# EAGLE design dc-dcconverter (EAGLE 9.6.2)
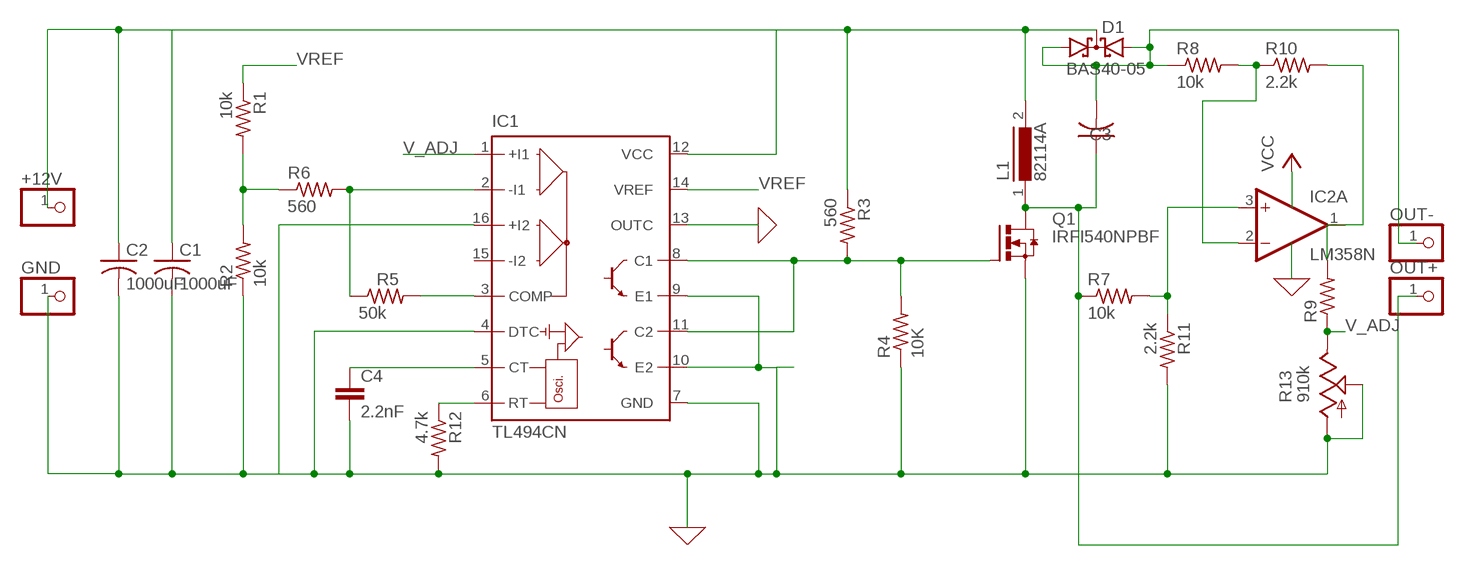
[diagram p0: schematic, sheet 1]

## Parts
+12V  PINHD-1X1  [1X01]
C1  1000uF  C-US025-024X044  [C025-024X044]
C2  1000uF  C-US025-024X044  [C025-024X044]
C3  C-US025-024X044  [C025-024X044]
C4  2.2nF  C2,5-3  [C2.5-3]
D1  BAS40-05  [SOT23]
GND  PINHD-1X1  [1X01]
IC1  TL494CN  [DIL16]
IC2  LM358N  [DIL08]
L1  82114A  [82114A]
OUT+  PINHD-1X1  [1X01]
OUT-  PINHD-1X1  [1X01]
Q1  IRFI540NPBF  [TO220BH]
R1  10k  R-US_0204/5  [0204/5]
R2  10k  R-US_0204/5  [0204/5]
R3  560  R-US_0204/5  [0204/5]
R4  10K  R-US_0204/5  [0204/5]
R5  50k  R-US_0204/5  [0204/5]
R6  560  R-US_0204/5  [0204/5]
R7  10k  R-US_0204/5  [0204/5]
R8  10k  R-US_0204/5  [0204/5]
R9  R-US_0204/5  [0204/5]
R10  2.2k  R-US_0204/5  [0204/5]
R11  2.2k  R-US_0204/5  [0204/5]
R12  4.7k  R-US_0204/5  [0204/5]
R13  910k  TRIM_US-CA6H  [CA6H]

## Nets
0: IC1.13(OUTC) ; supply symbol labelled GND
GND: C1.2 C2.2 C4.2 GND.1 IC1.4(DTC) IC1.7(GND) IC1.9(E1) IC1.10(E2) IC1.16(+I2) Q1.S R2.1 R4.1 R11.2 R12.2 R13.A R13.S
N$1: IC1.2(-I1) R5.1 R6.2
N$2: IC1.3(COMP) R5.2
N$4: IC1.6(RT) R12.1
N$5: C4.1 IC1.5(CT)
N$6: IC1.8(C1) IC1.11(C2) Q1.G R3.2 R4.2
N$7: IC2.2(A:-IN) R8.2 R10.1
N$8: C3.1 L1.1 OUT+.1 Q1.D R7.1
N$9: C3.2 D1.1(A1) D1.2(A2) OUT-.1 R8.1
N$10: IC2.1(A:OUT) R9.2 R10.2
N$11: R1.2 R2.2 R6.1
N$12: IC1.14(VREF)
N$13: IC2.3(A:+IN) R7.2 R11.1
N$14: IC1.1(+I1)
N$15: +12V.1 C1.1 C2.1 D1.3(C) IC1.12(VCC) L1.2 R3.1
V_ADJ: R9.1 R13.E
VREF: R1.1
Unconnected: IC1.15(-I2) IC2.5(B:+IN) IC2.6(B:-IN) IC2.7(B:OUT)

## Power pins joined to a net without a drawn wire
V+: IC2.8(P:V+)
V-: IC2.4(P:V-)

## Library data of the parts
+12V GND OUT+ OUT- = adafruit:PINHD-1X1: Pin header 1x1 for 0.1" spacing With round pins
C1-C3 = adafruit:C-US: CAPACITOR, American symbol
C4 = capacitor-wima:C: CAPACITOR naming: grid - package width
D1 = diode:BAS40-05: Silicon Schottky Diodes General-purpose diode for high-speed switching
IC1 = linear:TL494*: SWITCHMODE Pulse Width Modulation Control Circuit NCV494B http://onsemi.com tl494-d.pdf
IC2 = linear:LM358: OP AMP also LM158; LM258; LM2904 Source: http://cache.national.com/ds/LM/LM158.pdf
L1 = inductors:82114A: INDUCTOR; SPICEPREFIX: L
Q1 = transistor-power:IRFI540NPBF: HEXFET Power MOISFET VDSS = 100V, RDS(on) = 0.052 Ohm, ID = 20A, VGS(th) = 2.0 -- 4.0V Source: http://www.irf.com/product-info/datasheets/data/irfi540npbf.pdf
R1-R12 = rcl:R-US_: RESISTOR, American symbol; SPICEPREFIX: R
R13 = pot:TRIM_US-: POTENTIOMETER

## Board
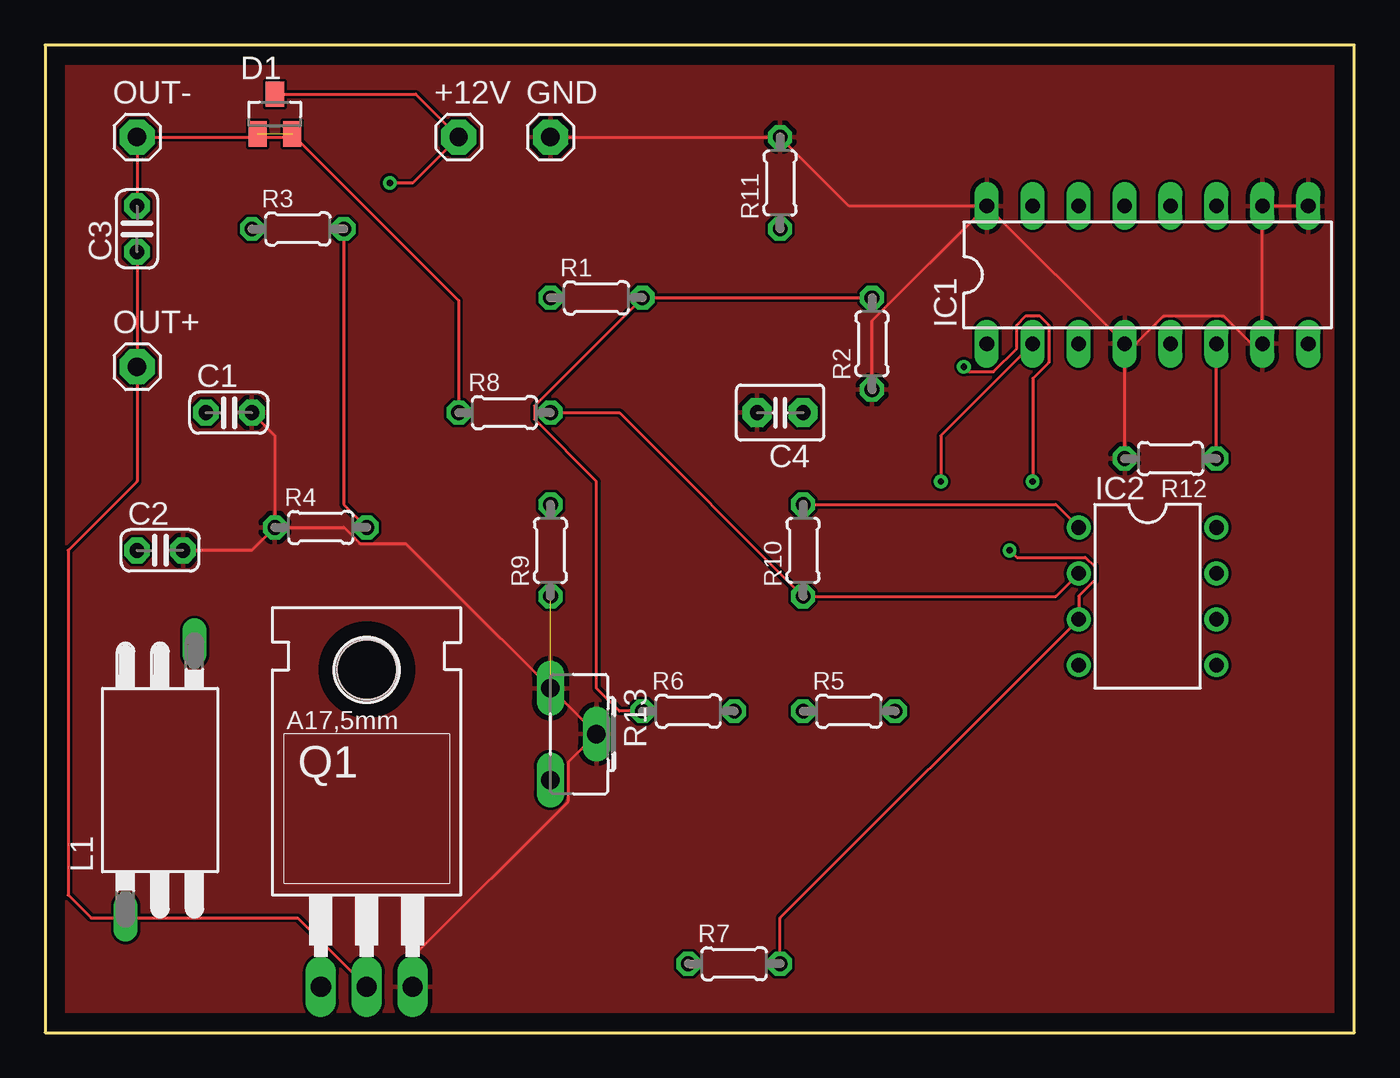
[diagram p1: board, top side]
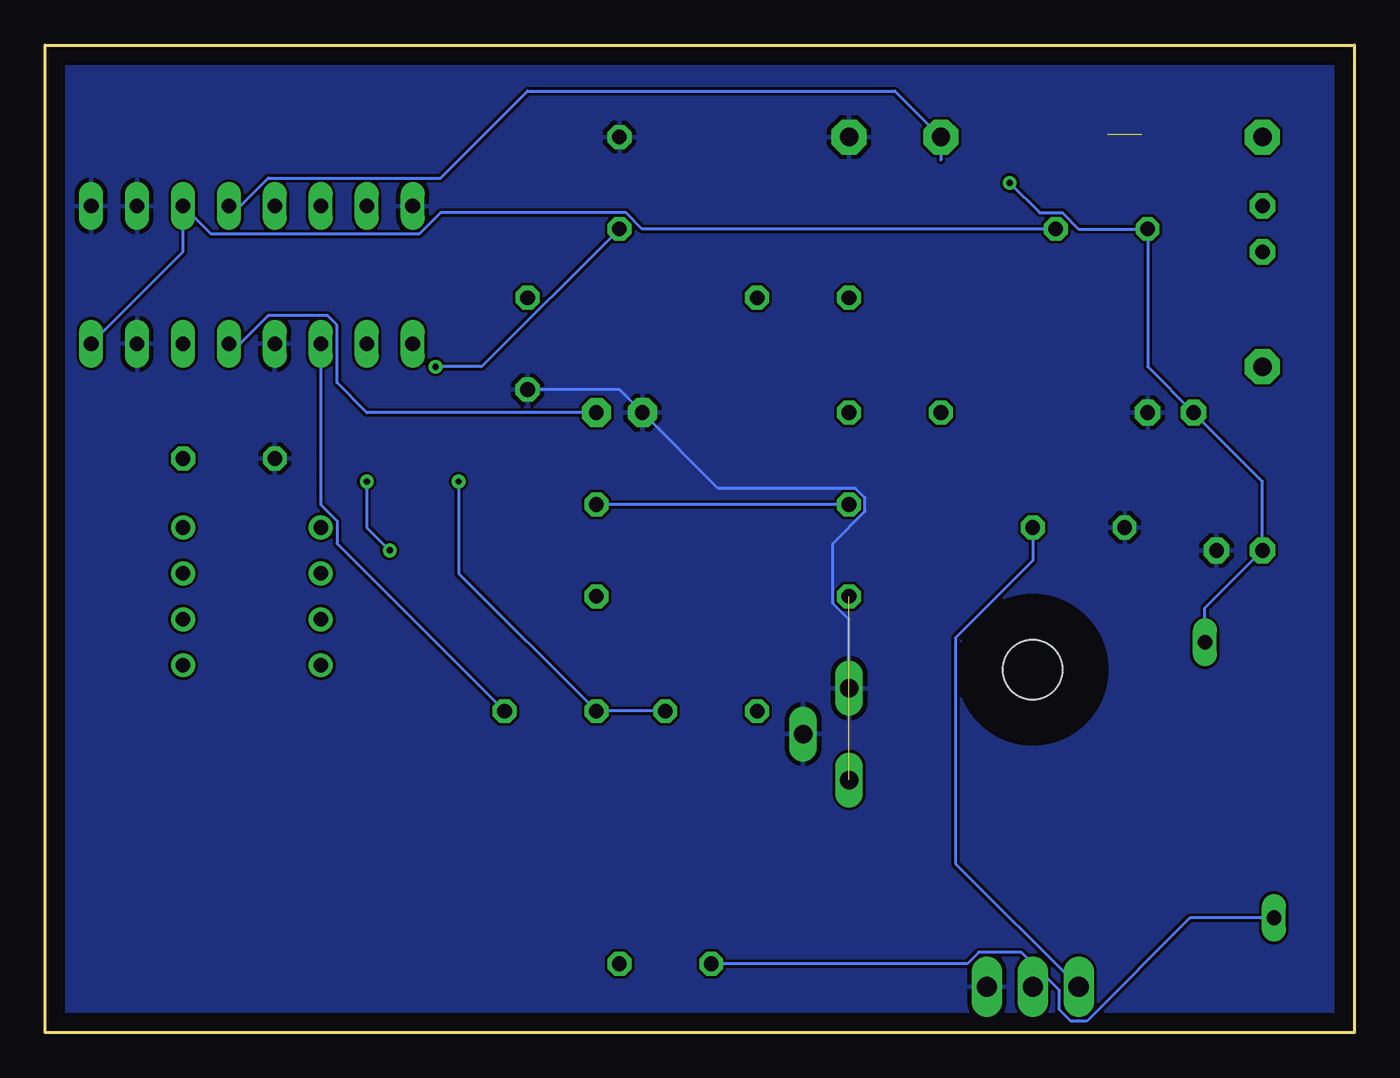
[diagram p2: board, bottom side, seen from below]

Size 72.39 x 54.61 mm. Coordinates in mm from the lower left corner, seen from the top.
Outline: 0,54.61 0,0 72.39,0 72.39,54.61 0,54.61
Copper layers (1*16): Top 0.035mm / dielectric 1.5mm / Bottom 0.035mm
Design rules "default": minimum track width 6mil, minimum drill 0.35mm, track to track 6mil, track to pad 6mil, pad to pad 6mil, via to via 6mil, smd to smd 6mil, copper to edge 40mil, drill to drill 6mil, minimum pad ring 10mil, minimum via ring 8mil, stop-mask expansion 4mil, vias tented up to drill 0mil, thermal gap 10mil

### Footprints (pad centres in the part's own frame; a part is rotated, then mirrored left to right if it is on the bottom)
1X01 = drill 1.016 pad 1.93 octagon: 1 0,0
C025-024X044 = drill 0.813 pad 1.422 octagon: 1 -1.27,0; 2 1.27,0
C2.5-3 = drill 0.813 pad 1.6 octagon: 1 -1.27,0; 2 1.27,0
SOT23 = smd 1 x 1.4: 1 -0.95,-1.1; 2 0.95,-1.1; 3 0,1.1
DIL16 = drill 0.813 long: 1 -8.89,-3.81; 2 -6.35,-3.81; 3 -3.81,-3.81; 4 -1.27,-3.81; 5 1.27,-3.81; 6 3.81,-3.81; 7 6.35,-3.81; 8 8.89,-3.81; 9 8.89,3.81; 10 6.35,3.81; 11 3.81,3.81; 12 1.27,3.81; 13 -1.27,3.81; 14 -3.81,3.81; 15 -6.35,3.81; 16 -8.89,3.81
DIL08 = drill 0.813 pad 1.27: 1 -3.81,-3.81; 2 -1.27,-3.81; 3 1.27,-3.81; 4 3.81,-3.81; 5 3.81,3.81; 6 1.27,3.81; 7 -1.27,3.81; 8 -3.81,3.81
82114A = drill 0.813 long: 1 -7.62,1.905; 2 7.62,-1.905
TO220BH = drill 1.118 long: D 0,-6.35; G -2.54,-6.35; S 2.54,-6.35 | hole 3.302: 0,11.176
0204/5 = drill 0.813 octagon: 1 -2.54,0; 2 2.54,0
CA6H = drill 1.016 long: A -2.54,0; E 2.54,0; S 0,2.54

### Placement (x,y rotation side)
+12V  22.86,49.53 0 top
C1  10.16,34.29 0 top
C2  6.35,26.67 0 top
C3  5.08,44.45 90 top
C4  40.64,34.29 180 top
D1  12.7,50.8 0 top
GND  27.94,49.53 0 top
IC1  60.96,41.91 0 top
IC2  60.96,24.13 270 top
L1  6.35,13.97 90 top
OUT+  5.08,36.83 0 top
OUT-  5.08,49.53 0 top
Q1  17.78,8.89 0 top
R1  30.48,40.64 0 top
R2  45.72,38.1 90 top
R3  13.97,44.45 0 top
R4  15.24,27.94 0 top
R5  44.45,17.78 0 top
R6  35.56,17.78 0 top
R7  38.1,3.81 0 top
R8  25.4,34.29 0 top
R9  27.94,26.67 90 top
R10  41.91,26.67 90 top
R11  40.64,46.99 90 top
R12  62.23,31.75 180 top
R13  27.94,16.51 270 top

### Tracks (layer width: path | path; a pad name or v marks a point on that pad's centre or on a via)
GND
  Top 0.152: R12.2 IC1.4 | IC1.4 60.31,38.1 61.86,39.65 65.14,39.65 66.69,38.1 IC1.7 IC1.10 IC1.9 | Q1.S 20.32,4.19 28.93,12.8 28.93,14.96 R13.S 19.94,27.05 17.41,27.05 16.52,27.94 R4.1 | C1.2 12.7,33.02 R4.1 | GND.1 R11.2 44.45,45.72 IC1.16 | R4.1 11.43,26.67 C2.2 | IC1.4 IC1.16 | R2.1 45.72,39.37 IC1.16
  Bottom 0.152: R13.A 27.94,22.86 28.83,23.75 28.83,27.06 27.05,28.84 27.05,29.58 27.57,30.1 35.18,30.1 C4.2 40.64,35.56 R2.1
  pour Top (isolate 0.001): 0,53.34 0,0 72.39,0 72.39,54.61 0,54.61
  pour Bottom (isolate 0.001): 0,54.61 0,0 72.39,0 72.39,54.61
N$1  (via drill 0.35)
  Top 0.152: IC1.2 49.53,33.02 v49.53,30.48
  Bottom 0.152: v49.53,30.48 49.53,25.4 R5.1 R6.2
N$2
  Bottom 0.152: IC1.3 57.15,29.2 56.26,28.31 56.26,27.05 R5.2
N$4
  Top 0.152: R12.1 IC1.6
N$5
  Bottom 0.152: IC1.5 61.61,38.1 60.06,39.65 56.78,39.65 56.26,39.13 56.26,35.94 54.61,34.29 C4.1
N$6
  Top 0.152: R3.2 16.51,29.21 R4.2
  Bottom 0.152: R4.2 17.78,26.1 22.05,21.83 22.05,9.35 Q1.G | R3.2 39.38,44.45 40.27,45.34 50.53,45.34 51.7,44.17 63.22,44.17 IC1.11 64.77,43.18 IC1.8
N$7
  Top 0.152: R8.2 31.75,34.29 R10.1 55.88,24.13 IC2.2
N$8
  Top 0.152: C3.1 OUT+.1 5.08,30.48 1.27,26.67 1.27,7.62 2.54,6.35 L1.1 13.97,6.35 Q1.D
  Bottom 0.152: L1.1 9.08,6.35 14.8,0.64 15.68,0.64 16.31,1.26 16.31,2.34 18.41,4.45 20.76,4.45 21.4,3.81 R7.1
N$9  (1 unrouted)
  Top 0.152: D1.2 13.82,49.53 | 13.82,49.53 22.86,40.49 R8.1 | 13.82,49.53 OUT-.1 C3.2
N$10
  Top 0.152: R10.2 55.88,29.21 IC2.1
  Bottom 0.152: R9.2 R10.2
N$11
  Top 0.152: R6.1 31.75,17.78 30.48,19.05 30.48,30.49 27.05,33.92 27.05,34.66 33.02,40.63 R1.2 R2.2
N$13  (via drill 0.35)
  Top 0.152: R7.2 40.64,6.35 IC2.3 57.15,24.14 58.04,25.03 58.04,25.77 57.52,26.29 53.72,26.29 v53.34,26.67 | v50.8,36.83 51.08,36.55 52.44,36.55 53.72,37.83 53.72,39.13 54.24,39.65 54.98,39.65 55.5,39.13 55.5,37.07 54.61,36.18 v54.61,30.48
  Bottom 0.152: R11.1 48.26,36.83 v50.8,36.83 | v54.61,30.48 54.61,27.94 v53.34,26.67
N$15  (via drill 0.35)
  Top 0.152: D1.3 20.49,51.9 +12V.1 20.32,46.99 v19.05,46.99
  Bottom 0.152: v19.05,46.99 17.4,45.34 16.14,45.34 15.25,44.45 R3.1 11.43,36.83 C1.1 5.08,30.48 C2.1 8.26,23.5 L1.2 | IC1.12 61.61,45.72 60.06,47.27 50.52,47.27 45.72,52.07 25.4,52.07 +12V.1 22.86,48.26
V_ADJ  (1 unrouted)